# Altium schematic sheet ZYNQ_BANK.SchDoc: PL Bank
size 431 x 279 mm
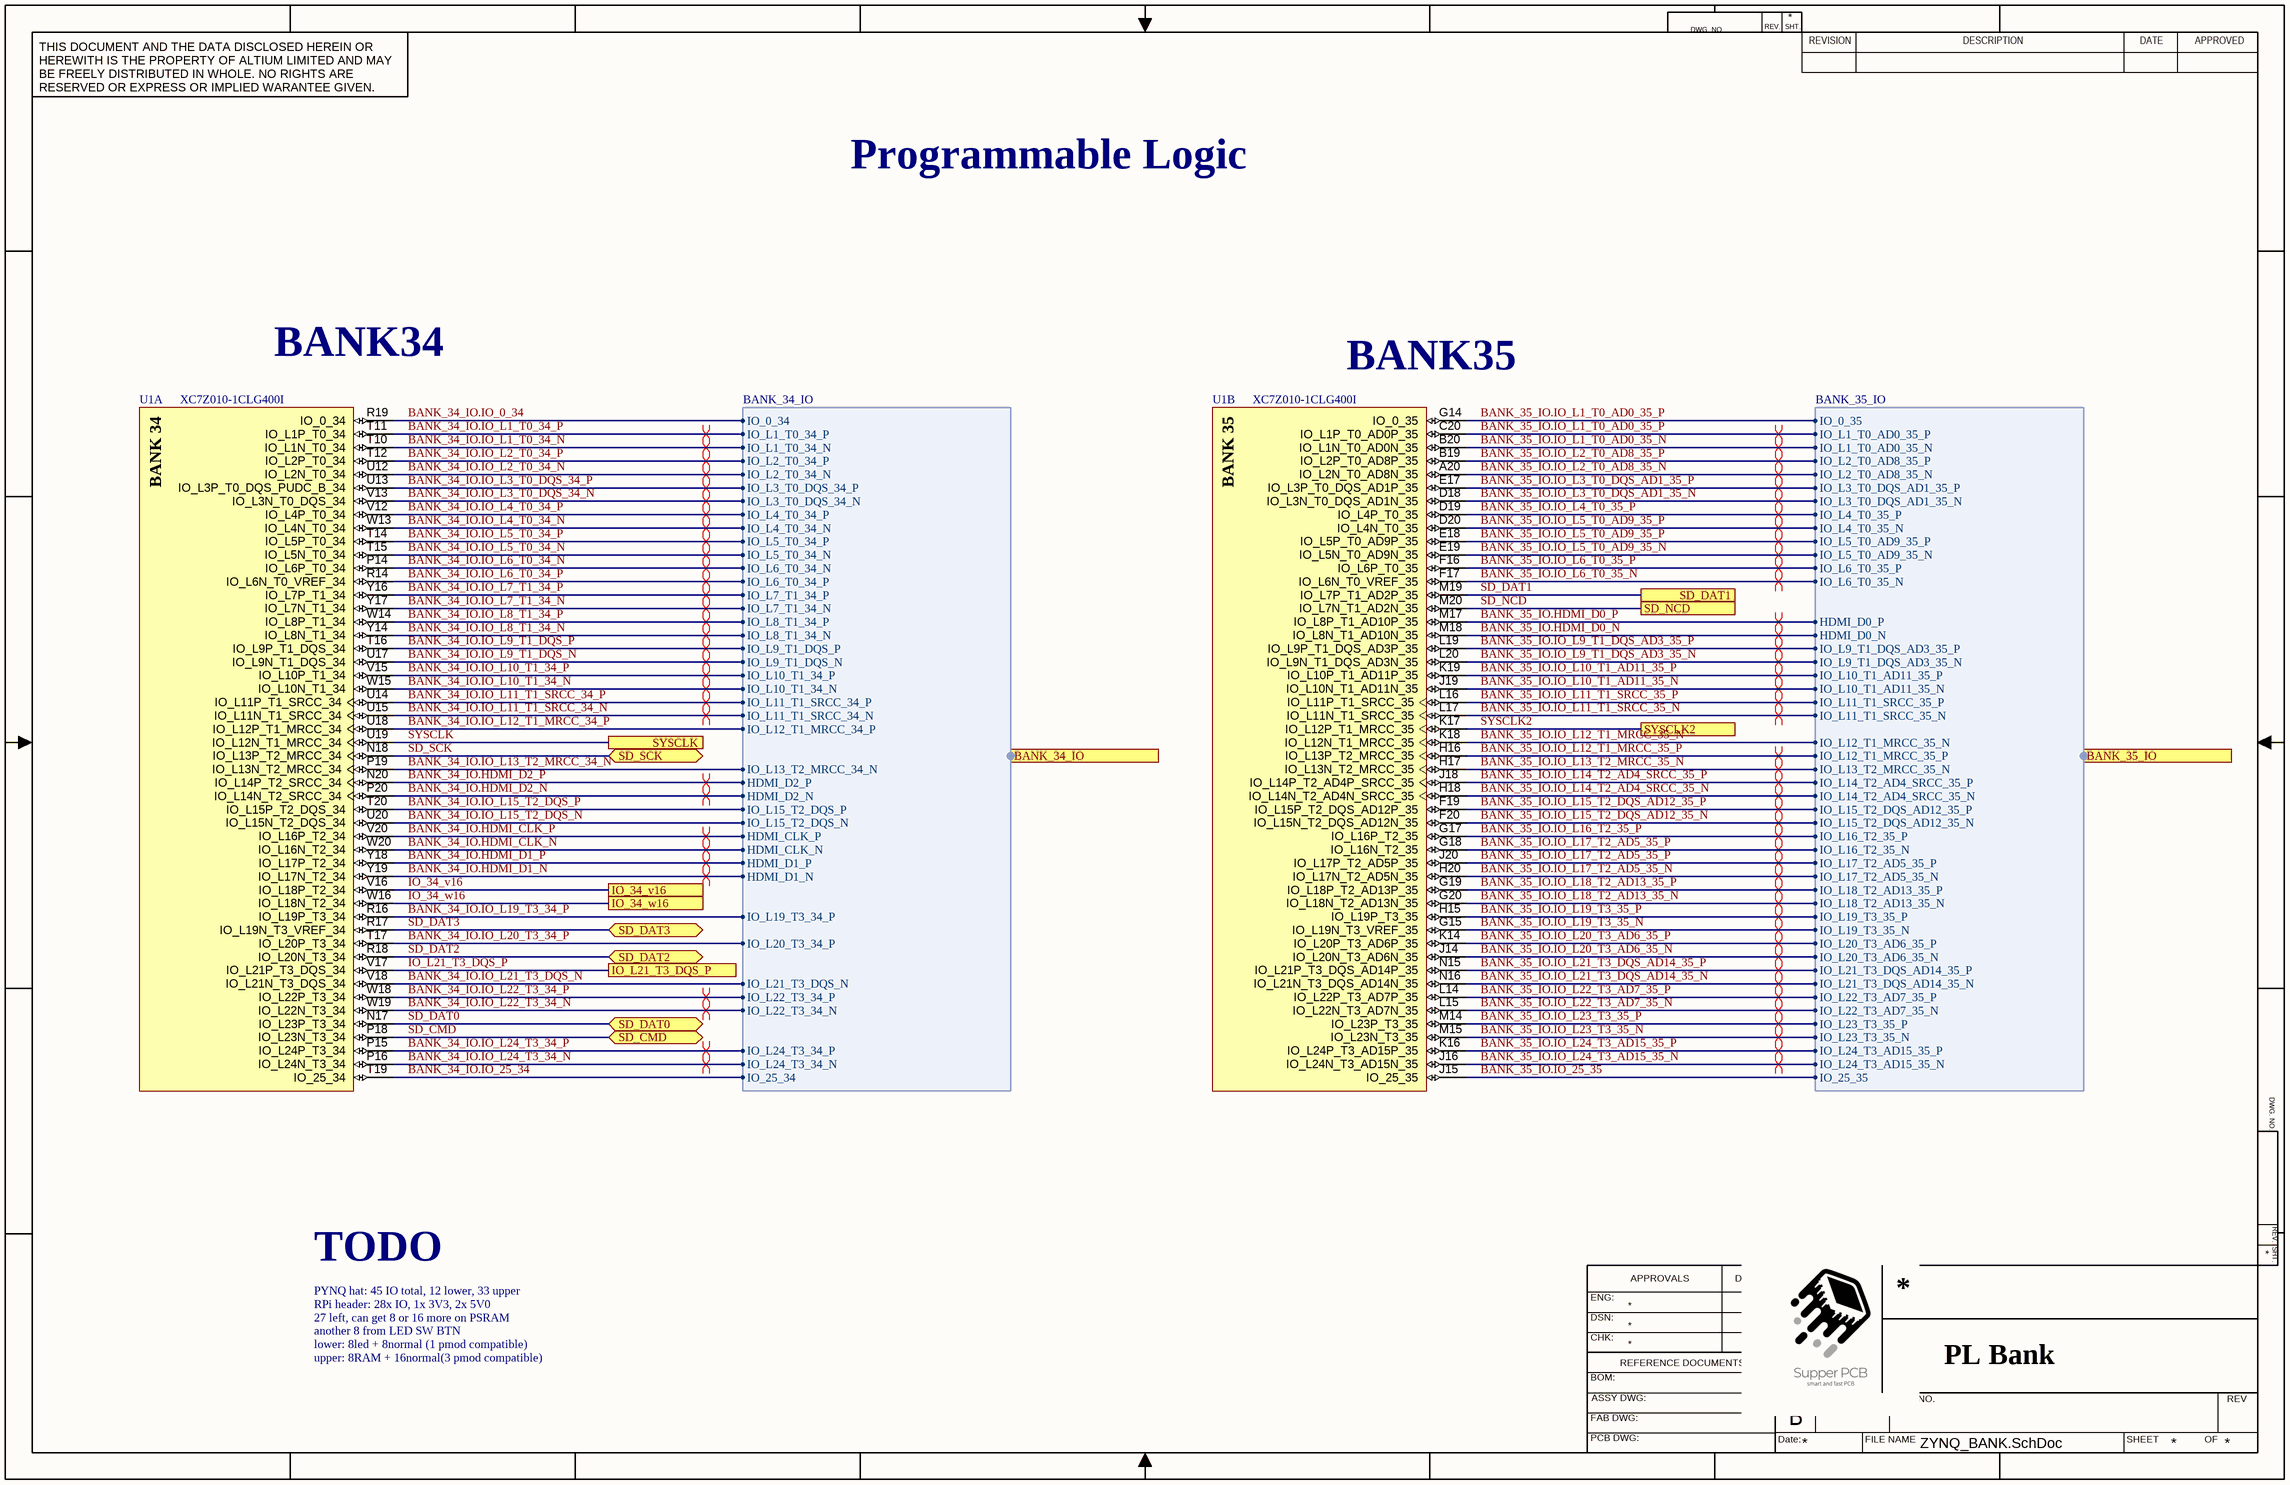
[diagram p0: ZYNQ_BANK.SchDoc]

## Parts
U1  XC7Z010-1CLG400I  [CLG400]  (parts A,B of 9)

## Ports
BANK_34_IO (harness BANK_34_IO), BANK_35_IO (harness BANK_35_IO), IO_34_v16, IO_34_w16, IO_L21_T3_DQS_P, SD_CMD (bidir), SD_DAT0 (bidir), SD_DAT1, SD_DAT2 (bidir), SD_DAT3 (bidir), SD_NCD, SD_SCK (bidir), SYSCLK, SYSCLK2

## Harnesses
BANK_35_IO: IO_0_35, IO_L1_T0_AD0_35_P, IO_L1_T0_AD0_35_N, IO_L2_T0_AD8_35_P, IO_L2_T0_AD8_35_N, IO_L3_T0_DQS_AD1_35_P, IO_L3_T0_DQS_AD1_35_N, IO_L4_T0_35_P, IO_L4_T0_35_N, IO_L5_T0_AD9_35_P, IO_L5_T0_AD9_35_N, IO_L6_T0_35_P, IO_L6_T0_35_N, HDMI_D0_P, HDMI_D0_N, IO_L9_T1_DQS_AD3_35_P, IO_L9_T1_DQS_AD3_35_N, IO_L10_T1_AD11_35_P, IO_L10_T1_AD11_35_N, IO_L11_T1_SRCC_35_P, IO_L11_T1_SRCC_35_N, IO_L12_T1_MRCC_35_N, IO_L12_T1_MRCC_35_P, IO_L13_T2_MRCC_35_N, IO_L14_T2_AD4_SRCC_35_P, IO_L14_T2_AD4_SRCC_35_N, IO_L15_T2_DQS_AD12_35_P, IO_L15_T2_DQS_AD12_35_N, IO_L16_T2_35_P, IO_L16_T2_35_N, IO_L17_T2_AD5_35_P, IO_L17_T2_AD5_35_N, IO_L18_T2_AD13_35_P, IO_L18_T2_AD13_35_N, IO_L19_T3_35_P, IO_L19_T3_35_N, IO_L20_T3_AD6_35_P, IO_L20_T3_AD6_35_N, IO_L21_T3_DQS_AD14_35_P, IO_L21_T3_DQS_AD14_35_N, IO_L22_T3_AD7_35_P, IO_L22_T3_AD7_35_N, IO_L23_T3_35_P, IO_L23_T3_35_N, IO_L24_T3_AD15_35_P, IO_L24_T3_AD15_35_N, IO_25_35
BANK_34_IO: IO_0_34, IO_L1_T0_34_P, IO_L1_T0_34_N, IO_L2_T0_34_P, IO_L2_T0_34_N, IO_L3_T0_DQS_34_P, IO_L3_T0_DQS_34_N, IO_L4_T0_34_P, IO_L4_T0_34_N, IO_L5_T0_34_P, IO_L5_T0_34_N, IO_L6_T0_34_N, IO_L6_T0_34_P, IO_L7_T1_34_P, IO_L7_T1_34_N, IO_L8_T1_34_P, IO_L8_T1_34_N, IO_L9_T1_DQS_P, IO_L9_T1_DQS_N, IO_L10_T1_34_P, IO_L10_T1_34_N, IO_L11_T1_SRCC_34_P, IO_L11_T1_SRCC_34_N, IO_L12_T1_MRCC_34_P, IO_L13_T2_MRCC_34_N, HDMI_D2_P, HDMI_D2_N, IO_L15_T2_DQS_P, IO_L15_T2_DQS_N, HDMI_CLK_P, HDMI_CLK_N, HDMI_D1_P, HDMI_D1_N, IO_L19_T3_34_P, IO_L20_T3_34_P, IO_L21_T3_DQS_N, IO_L22_T3_34_P, IO_L22_T3_34_N, IO_L24_T3_34_P, IO_L24_T3_34_N, IO_25_34

## Nets
BANK_34_IO.HDMI_CLK_N: U1.W20(IO_L16N_T2_34) ; port BANK_34_IO.HDMI_CLK_N
BANK_34_IO.HDMI_CLK_P: U1.V20(IO_L16P_T2_34) ; port BANK_34_IO.HDMI_CLK_P
BANK_34_IO.HDMI_D1_N: U1.Y19(IO_L17N_T2_34) ; port BANK_34_IO.HDMI_D1_N
BANK_34_IO.HDMI_D1_P: U1.Y18(IO_L17P_T2_34) ; port BANK_34_IO.HDMI_D1_P
BANK_34_IO.HDMI_D2_N: U1.P20(IO_L14N_T2_SRCC_34) ; port BANK_34_IO.HDMI_D2_N
BANK_34_IO.HDMI_D2_P: U1.N20(IO_L14P_T2_SRCC_34) ; port BANK_34_IO.HDMI_D2_P
BANK_34_IO.IO_0_34: U1.R19(IO_0_34) ; port BANK_34_IO.IO_0_34
BANK_34_IO.IO_25_34: U1.T19(IO_25_34) ; port BANK_34_IO.IO_25_34
BANK_34_IO.IO_L1_T0_34_N: U1.T10(IO_L1N_T0_34) ; port BANK_34_IO.IO_L1_T0_34_N
BANK_34_IO.IO_L1_T0_34_P: U1.T11(IO_L1P_T0_34) ; port BANK_34_IO.IO_L1_T0_34_P
BANK_34_IO.IO_L2_T0_34_N: U1.U12(IO_L2N_T0_34) ; port BANK_34_IO.IO_L2_T0_34_N
BANK_34_IO.IO_L2_T0_34_P: U1.T12(IO_L2P_T0_34) ; port BANK_34_IO.IO_L2_T0_34_P
BANK_34_IO.IO_L3_T0_DQS_34_N: U1.V13(IO_L3N_T0_DQS_34) ; port BANK_34_IO.IO_L3_T0_DQS_34_N
BANK_34_IO.IO_L3_T0_DQS_34_P: U1.U13(IO_L3P_T0_DQS_PUDC_B_34) ; port BANK_34_IO.IO_L3_T0_DQS_34_P
BANK_34_IO.IO_L4_T0_34_N: U1.W13(IO_L4N_T0_34) ; port BANK_34_IO.IO_L4_T0_34_N
BANK_34_IO.IO_L4_T0_34_P: U1.V12(IO_L4P_T0_34) ; port BANK_34_IO.IO_L4_T0_34_P
BANK_34_IO.IO_L5_T0_34_N: U1.T15(IO_L5N_T0_34) ; port BANK_34_IO.IO_L5_T0_34_N
BANK_34_IO.IO_L5_T0_34_P: U1.T14(IO_L5P_T0_34) ; port BANK_34_IO.IO_L5_T0_34_P
BANK_34_IO.IO_L6_T0_34_N: U1.P14(IO_L6P_T0_34) ; port BANK_34_IO.IO_L6_T0_34_N
BANK_34_IO.IO_L6_T0_34_P: U1.R14(IO_L6N_T0_VREF_34) ; port BANK_34_IO.IO_L6_T0_34_P
BANK_34_IO.IO_L7_T1_34_N: U1.Y17(IO_L7N_T1_34) ; port BANK_34_IO.IO_L7_T1_34_N
BANK_34_IO.IO_L7_T1_34_P: U1.Y16(IO_L7P_T1_34) ; port BANK_34_IO.IO_L7_T1_34_P
BANK_34_IO.IO_L8_T1_34_N: U1.Y14(IO_L8N_T1_34) ; port BANK_34_IO.IO_L8_T1_34_N
BANK_34_IO.IO_L8_T1_34_P: U1.W14(IO_L8P_T1_34) ; port BANK_34_IO.IO_L8_T1_34_P
BANK_34_IO.IO_L9_T1_DQS_N: U1.U17(IO_L9N_T1_DQS_34) ; port BANK_34_IO.IO_L9_T1_DQS_N
BANK_34_IO.IO_L9_T1_DQS_P: U1.T16(IO_L9P_T1_DQS_34) ; port BANK_34_IO.IO_L9_T1_DQS_P
BANK_34_IO.IO_L10_T1_34_N: U1.W15(IO_L10N_T1_34) ; port BANK_34_IO.IO_L10_T1_34_N
BANK_34_IO.IO_L10_T1_34_P: U1.V15(IO_L10P_T1_34) ; port BANK_34_IO.IO_L10_T1_34_P
BANK_34_IO.IO_L11_T1_SRCC_34_N: U1.U15(IO_L11N_T1_SRCC_34) ; port BANK_34_IO.IO_L11_T1_SRCC_34_N
BANK_34_IO.IO_L11_T1_SRCC_34_P: U1.U14(IO_L11P_T1_SRCC_34) ; port BANK_34_IO.IO_L11_T1_SRCC_34_P
BANK_34_IO.IO_L12_T1_MRCC_34_P: U1.U18(IO_L12P_T1_MRCC_34) ; port BANK_34_IO.IO_L12_T1_MRCC_34_P
BANK_34_IO.IO_L13_T2_MRCC_34_N: U1.P19(IO_L13N_T2_MRCC_34) ; port BANK_34_IO.IO_L13_T2_MRCC_34_N
BANK_34_IO.IO_L15_T2_DQS_N: U1.U20(IO_L15N_T2_DQS_34) ; port BANK_34_IO.IO_L15_T2_DQS_N
BANK_34_IO.IO_L15_T2_DQS_P: U1.T20(IO_L15P_T2_DQS_34) ; port BANK_34_IO.IO_L15_T2_DQS_P
BANK_34_IO.IO_L19_T3_34_P: U1.R16(IO_L19P_T3_34) ; port BANK_34_IO.IO_L19_T3_34_P
BANK_34_IO.IO_L20_T3_34_P: U1.T17(IO_L20P_T3_34) ; port BANK_34_IO.IO_L20_T3_34_P
BANK_34_IO.IO_L21_T3_DQS_N: U1.V18(IO_L21N_T3_DQS_34) ; port BANK_34_IO.IO_L21_T3_DQS_N
BANK_34_IO.IO_L22_T3_34_N: U1.W19(IO_L22N_T3_34) ; port BANK_34_IO.IO_L22_T3_34_N
BANK_34_IO.IO_L22_T3_34_P: U1.W18(IO_L22P_T3_34) ; port BANK_34_IO.IO_L22_T3_34_P
BANK_34_IO.IO_L24_T3_34_N: U1.P16(IO_L24N_T3_34) ; port BANK_34_IO.IO_L24_T3_34_N
BANK_34_IO.IO_L24_T3_34_P: U1.P15(IO_L24P_T3_34) ; port BANK_34_IO.IO_L24_T3_34_P
BANK_35_IO.HDMI_D0_N: U1.M18(IO_L8N_T1_AD10N_35) ; port BANK_35_IO.HDMI_D0_N
BANK_35_IO.HDMI_D0_P: U1.M17(IO_L8P_T1_AD10P_35) ; port BANK_35_IO.HDMI_D0_P
BANK_35_IO.IO_25_35: U1.J15(IO_25_35) ; port BANK_35_IO.IO_25_35
BANK_35_IO.IO_L1_T0_AD0_35_N: U1.B20(IO_L1N_T0_AD0N_35) ; port BANK_35_IO.IO_L1_T0_AD0_35_N
BANK_35_IO.IO_L1_T0_AD0_35_P: U1.C20(IO_L1P_T0_AD0P_35) U1.G14(IO_0_35) ; port BANK_35_IO.IO_0_35, port BANK_35_IO.IO_L1_T0_AD0_35_P
BANK_35_IO.IO_L2_T0_AD8_35_N: U1.A20(IO_L2N_T0_AD8N_35) ; port BANK_35_IO.IO_L2_T0_AD8_35_N
BANK_35_IO.IO_L2_T0_AD8_35_P: U1.B19(IO_L2P_T0_AD8P_35) ; port BANK_35_IO.IO_L2_T0_AD8_35_P
BANK_35_IO.IO_L3_T0_DQS_AD1_35_N: U1.D18(IO_L3N_T0_DQS_AD1N_35) ; port BANK_35_IO.IO_L3_T0_DQS_AD1_35_N
BANK_35_IO.IO_L3_T0_DQS_AD1_35_P: U1.E17(IO_L3P_T0_DQS_AD1P_35) ; port BANK_35_IO.IO_L3_T0_DQS_AD1_35_P
BANK_35_IO.IO_L4_T0_35_P: U1.D19(IO_L4P_T0_35) ; port BANK_35_IO.IO_L4_T0_35_P
BANK_35_IO.IO_L5_T0_AD9_35_N: U1.E19(IO_L5N_T0_AD9N_35) ; port BANK_35_IO.IO_L5_T0_AD9_35_N
BANK_35_IO.IO_L5_T0_AD9_35_P: U1.D20(IO_L4N_T0_35) U1.E18(IO_L5P_T0_AD9P_35) ; port BANK_35_IO.IO_L4_T0_35_N, port BANK_35_IO.IO_L5_T0_AD9_35_P
BANK_35_IO.IO_L6_T0_35_N: U1.F17(IO_L6N_T0_VREF_35) ; port BANK_35_IO.IO_L6_T0_35_N
BANK_35_IO.IO_L6_T0_35_P: U1.F16(IO_L6P_T0_35) ; port BANK_35_IO.IO_L6_T0_35_P
BANK_35_IO.IO_L9_T1_DQS_AD3_35_N: U1.L20(IO_L9N_T1_DQS_AD3N_35) ; port BANK_35_IO.IO_L9_T1_DQS_AD3_35_N
BANK_35_IO.IO_L9_T1_DQS_AD3_35_P: U1.L19(IO_L9P_T1_DQS_AD3P_35) ; port BANK_35_IO.IO_L9_T1_DQS_AD3_35_P
BANK_35_IO.IO_L10_T1_AD11_35_N: U1.J19(IO_L10N_T1_AD11N_35) ; port BANK_35_IO.IO_L10_T1_AD11_35_N
BANK_35_IO.IO_L10_T1_AD11_35_P: U1.K19(IO_L10P_T1_AD11P_35) ; port BANK_35_IO.IO_L10_T1_AD11_35_P
BANK_35_IO.IO_L11_T1_SRCC_35_N: U1.L17(IO_L11N_T1_SRCC_35) ; port BANK_35_IO.IO_L11_T1_SRCC_35_N
BANK_35_IO.IO_L11_T1_SRCC_35_P: U1.L16(IO_L11P_T1_SRCC_35) ; port BANK_35_IO.IO_L11_T1_SRCC_35_P
BANK_35_IO.IO_L12_T1_MRCC_35_N: U1.K18(IO_L12N_T1_MRCC_35) ; port BANK_35_IO.IO_L12_T1_MRCC_35_N
BANK_35_IO.IO_L12_T1_MRCC_35_P: U1.H16(IO_L13P_T2_MRCC_35) ; port BANK_35_IO.IO_L12_T1_MRCC_35_P
BANK_35_IO.IO_L13_T2_MRCC_35_N: U1.H17(IO_L13N_T2_MRCC_35) ; port BANK_35_IO.IO_L13_T2_MRCC_35_N
BANK_35_IO.IO_L14_T2_AD4_SRCC_35_N: U1.H18(IO_L14N_T2_AD4N_SRCC_35) ; port BANK_35_IO.IO_L14_T2_AD4_SRCC_35_N
BANK_35_IO.IO_L14_T2_AD4_SRCC_35_P: U1.J18(IO_L14P_T2_AD4P_SRCC_35) ; port BANK_35_IO.IO_L14_T2_AD4_SRCC_35_P
BANK_35_IO.IO_L15_T2_DQS_AD12_35_N: U1.F20(IO_L15N_T2_DQS_AD12N_35) ; port BANK_35_IO.IO_L15_T2_DQS_AD12_35_N
BANK_35_IO.IO_L15_T2_DQS_AD12_35_P: U1.F19(IO_L15P_T2_DQS_AD12P_35) ; port BANK_35_IO.IO_L15_T2_DQS_AD12_35_P
BANK_35_IO.IO_L16_T2_35_P: U1.G17(IO_L16P_T2_35) ; port BANK_35_IO.IO_L16_T2_35_P
BANK_35_IO.IO_L17_T2_AD5_35_N: U1.H20(IO_L17N_T2_AD5N_35) ; port BANK_35_IO.IO_L17_T2_AD5_35_N
BANK_35_IO.IO_L17_T2_AD5_35_P: U1.G18(IO_L16N_T2_35) U1.J20(IO_L17P_T2_AD5P_35) ; port BANK_35_IO.IO_L16_T2_35_N, port BANK_35_IO.IO_L17_T2_AD5_35_P
BANK_35_IO.IO_L18_T2_AD13_35_N: U1.G20(IO_L18N_T2_AD13N_35) ; port BANK_35_IO.IO_L18_T2_AD13_35_N
BANK_35_IO.IO_L18_T2_AD13_35_P: U1.G19(IO_L18P_T2_AD13P_35) ; port BANK_35_IO.IO_L18_T2_AD13_35_P
BANK_35_IO.IO_L19_T3_35_N: U1.G15(IO_L19N_T3_VREF_35) ; port BANK_35_IO.IO_L19_T3_35_N
BANK_35_IO.IO_L19_T3_35_P: U1.H15(IO_L19P_T3_35) ; port BANK_35_IO.IO_L19_T3_35_P
BANK_35_IO.IO_L20_T3_AD6_35_N: U1.J14(IO_L20N_T3_AD6N_35) ; port BANK_35_IO.IO_L20_T3_AD6_35_N
BANK_35_IO.IO_L20_T3_AD6_35_P: U1.K14(IO_L20P_T3_AD6P_35) ; port BANK_35_IO.IO_L20_T3_AD6_35_P
BANK_35_IO.IO_L21_T3_DQS_AD14_35_N: U1.N16(IO_L21N_T3_DQS_AD14N_35) ; port BANK_35_IO.IO_L21_T3_DQS_AD14_35_N
BANK_35_IO.IO_L21_T3_DQS_AD14_35_P: U1.N15(IO_L21P_T3_DQS_AD14P_35) ; port BANK_35_IO.IO_L21_T3_DQS_AD14_35_P
BANK_35_IO.IO_L22_T3_AD7_35_N: U1.L15(IO_L22N_T3_AD7N_35) ; port BANK_35_IO.IO_L22_T3_AD7_35_N
BANK_35_IO.IO_L22_T3_AD7_35_P: U1.L14(IO_L22P_T3_AD7P_35) ; port BANK_35_IO.IO_L22_T3_AD7_35_P
BANK_35_IO.IO_L23_T3_35_N: U1.M15(IO_L23N_T3_35) ; port BANK_35_IO.IO_L23_T3_35_N
BANK_35_IO.IO_L23_T3_35_P: U1.M14(IO_L23P_T3_35) ; port BANK_35_IO.IO_L23_T3_35_P
BANK_35_IO.IO_L24_T3_AD15_35_N: U1.J16(IO_L24N_T3_AD15N_35) ; port BANK_35_IO.IO_L24_T3_AD15_35_N
BANK_35_IO.IO_L24_T3_AD15_35_P: U1.K16(IO_L24P_T3_AD15P_35) ; port BANK_35_IO.IO_L24_T3_AD15_35_P
IO_34_v16: U1.V16(IO_L18P_T2_34) ; port IO_34_v16
IO_34_w16: U1.W16(IO_L18N_T2_34) ; port IO_34_w16
IO_L21_T3_DQS_P: U1.V17(IO_L21P_T3_DQS_34) ; port IO_L21_T3_DQS_P
SD_CMD: U1.P18(IO_L23N_T3_34) ; port SD_CMD
SD_DAT0: U1.N17(IO_L23P_T3_34) ; port SD_DAT0
SD_DAT1: U1.M19(IO_L7P_T1_AD2P_35) ; port SD_DAT1
SD_DAT2: U1.R18(IO_L20N_T3_34) ; port SD_DAT2
SD_DAT3: U1.R17(IO_L19N_T3_VREF_34) ; port SD_DAT3
SD_NCD: U1.M20(IO_L7N_T1_AD2N_35) ; port SD_NCD
SD_SCK: U1.N18(IO_L13P_T2_MRCC_34) ; port SD_SCK
SYSCLK: U1.U19(IO_L12N_T1_MRCC_34) ; port SYSCLK
SYSCLK2: U1.K17(IO_L12P_T1_MRCC_35) ; port SYSCLK2

## Layout directives
differential pair: BANK_34_IO.HDMI_CLK_N, BANK_34_IO.HDMI_CLK_P, BANK_34_IO.HDMI_D1_N, BANK_34_IO.HDMI_D1_P, BANK_34_IO.HDMI_D2_N, BANK_34_IO.HDMI_D2_P, BANK_34_IO.IO_L1_T0_34_N, BANK_34_IO.IO_L1_T0_34_P, BANK_34_IO.IO_L2_T0_34_N, BANK_34_IO.IO_L2_T0_34_P, BANK_34_IO.IO_L3_T0_DQS_34_N, BANK_34_IO.IO_L3_T0_DQS_34_P, BANK_34_IO.IO_L4_T0_34_N, BANK_34_IO.IO_L4_T0_34_P, BANK_34_IO.IO_L5_T0_34_N, BANK_34_IO.IO_L5_T0_34_P, BANK_34_IO.IO_L6_T0_34_N, BANK_34_IO.IO_L6_T0_34_P, BANK_34_IO.IO_L7_T1_34_N, BANK_34_IO.IO_L7_T1_34_P, BANK_34_IO.IO_L8_T1_34_N, BANK_34_IO.IO_L8_T1_34_P, BANK_34_IO.IO_L9_T1_DQS_N, BANK_34_IO.IO_L9_T1_DQS_P, BANK_34_IO.IO_L10_T1_34_N, BANK_34_IO.IO_L10_T1_34_P, BANK_34_IO.IO_L11_T1_SRCC_34_N, BANK_34_IO.IO_L11_T1_SRCC_34_P, BANK_34_IO.IO_L22_T3_34_N, BANK_34_IO.IO_L22_T3_34_P, BANK_34_IO.IO_L24_T3_34_N, BANK_34_IO.IO_L24_T3_34_P, BANK_35_IO.HDMI_D0_N, BANK_35_IO.HDMI_D0_P, BANK_35_IO.IO_L1_T0_AD0_35_N, BANK_35_IO.IO_L1_T0_AD0_35_P, BANK_35_IO.IO_L2_T0_AD8_35_N, BANK_35_IO.IO_L2_T0_AD8_35_P, BANK_35_IO.IO_L3_T0_DQS_AD1_35_N, BANK_35_IO.IO_L3_T0_DQS_AD1_35_P, BANK_35_IO.IO_L4_T0_35_P, BANK_35_IO.IO_L5_T0_AD9_35_N, BANK_35_IO.IO_L5_T0_AD9_35_P, BANK_35_IO.IO_L6_T0_35_N, BANK_35_IO.IO_L6_T0_35_P, BANK_35_IO.IO_L9_T1_DQS_AD3_35_N, BANK_35_IO.IO_L9_T1_DQS_AD3_35_P, BANK_35_IO.IO_L10_T1_AD11_35_N, BANK_35_IO.IO_L10_T1_AD11_35_P, BANK_35_IO.IO_L11_T1_SRCC_35_N, BANK_35_IO.IO_L11_T1_SRCC_35_P, BANK_35_IO.IO_L12_T1_MRCC_35_P, BANK_35_IO.IO_L13_T2_MRCC_35_N, BANK_35_IO.IO_L14_T2_AD4_SRCC_35_N, BANK_35_IO.IO_L14_T2_AD4_SRCC_35_P, BANK_35_IO.IO_L15_T2_DQS_AD12_35_N, BANK_35_IO.IO_L15_T2_DQS_AD12_35_P, BANK_35_IO.IO_L16_T2_35_P, BANK_35_IO.IO_L17_T2_AD5_35_N, BANK_35_IO.IO_L17_T2_AD5_35_P, BANK_35_IO.IO_L18_T2_AD13_35_N, BANK_35_IO.IO_L18_T2_AD13_35_P, BANK_35_IO.IO_L19_T3_35_N, BANK_35_IO.IO_L19_T3_35_P, BANK_35_IO.IO_L20_T3_AD6_35_N, BANK_35_IO.IO_L20_T3_AD6_35_P, BANK_35_IO.IO_L21_T3_DQS_AD14_35_N, BANK_35_IO.IO_L21_T3_DQS_AD14_35_P, BANK_35_IO.IO_L22_T3_AD7_35_N, BANK_35_IO.IO_L22_T3_AD7_35_P, BANK_35_IO.IO_L23_T3_35_N, BANK_35_IO.IO_L23_T3_35_P, BANK_35_IO.IO_L24_T3_AD15_35_N, BANK_35_IO.IO_L24_T3_AD15_35_P

## Notes on the sheet
- Programmable Logic
- BANK34
- (near U1) BANK35
- PYNQ hat: 45 IO total, 12 lower, 33 upper
- TODO
- 27 left, can get 8 or 16 more on PSRAM
- another 8 from LED SW BTN
- lower: 8led + 8normal (1 pmod compatible)
- upper: 8RAM + 16normal(3 pmod compatible)
- RPi header: 28x IO, 1x 3V3, 2x 5V0
- DWG. NO.
- REV.
- SHT.
- THIS DOCUMENT AND THE DATA DISCLOSED HEREIN OR HEREWITH IS THE PROPERTY OF ALTIUM LIMITED AND MAY BE FREELY DISTRIBUTED IN WHOLE. NO RIGHTS ARE RESERVED OR EXPRESS OR IMPLIED WARANTEE GIVEN.
- REVISION
- DESCRIPTION
- DATE
- APPROVED
- ENG:
- APPROVALS
- DSN:
- CHK:
- REFERENCE DOCUMENTS
- BOM:
- FAB DWG:
- PCB DWG:
- ASSY DWG:
- Date:
- SIZE
- B
- Ver:
- FILE NAME
- DWG NO.
- SHEET
- OF
- REV
- (in symbol XC7Z010-1CLG400I, part A) BANK 34
- (in symbol XC7Z010-1CLG400I, part B) BANK 35

## Library data of the parts
U1 = XC7Z010-1CLG400I: 667 MHz Zynq?7000 AP SoC, 130 PS I/O, 100 FPGA I/O, 400-Ball BGA, Speed Grade 1, Industrial Grade, Pb-Free; Manufacturer: Xilinx; Extensible Block RAM (# 36Kb Blocks): 240 KB (60); Flip Flops: 35200; LUTs: 17600; Speed Grade: -1; DatasheetVersion: v1.2; PackageVersion: Rev 1.1; PackageReference: CLG400; PackageDescription: Wire-Bond Chip-Scale BGA, Body 17 x 17 mm, 0.8 mm Pitch; Generic Part Number: XC7Z010; RoHS: Pb-Free; Mounting Technology: Surface Mount; Code_JEDEC: MO-275-MMAA-1; PartNumber: XC7Z010-1CLG400I; ComponentLink1Description: Datasheet; ComponentLink1URL: http://www.xilinx.com/support/documentation/data_sheets/ds190-Zynq-7000-Overview.pdf; ComponentLink2Description: Package Specification; ComponentLink2URL: http://www.xilinx.com/support/documentation/user_guides/ug865-Zynq-7000-Pkg-Pinout.pdf; ComponentLink3Description: DC and AC Switching Characteristics; ComponentLink3URL: http://www.xilinx.com/support/documentation/data_sheets/ds187-XC7Z010-XC7Z020-Data-Sheet.pdf; ComponentLink4Description: Package File; ComponentLink4URL: http://www.xilinx.com/support/packagefiles/z7packages/xc7z010clg400pkg.txt; ComponentLink5Description: Packaging and Pinout; ComponentLink5URL: http://www.xilinx.com/support/documentation/user_guides/ug865-Zynq-7000-Pkg-Pinout.pdf; ComponentLink6Description: PCB and Layout Guide; ComponentLink6URL: http://www.xilinx.com/support/documentation/user_guides/ug483_7Series_PCB.pdf